# Altium project MyPCB01.PrjPcb
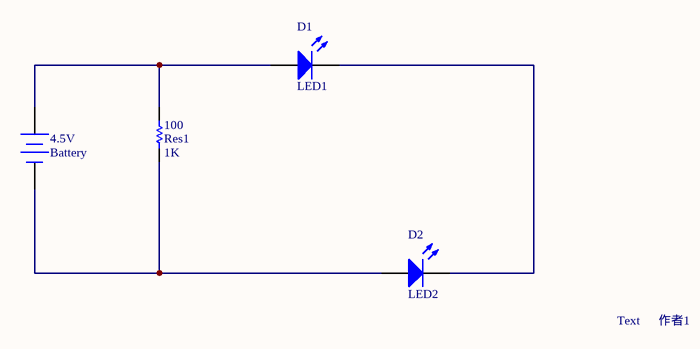
[diagram p0: MyFirstSch.SchDoc]
2 sheets, 5 parts. Net scope: global (net labels, ports and power ports of the same name join across sheets).
Board file: MyFirstPCB.PcbDoc
Sheets:
  MyFirstSch.SchDoc
  zf_2.SchDoc

## Sheet MyFirstSch.SchDoc
size A

### Parts
4.5V  Battery  [BAT-2]
100  Res1  value 1K  [AXIAL-0.3]
D1  LED1  [3.2X1.6X1.1]
D2  LED2  [3.2X1.6X1.1]

### Nets
Net4.5V_1: 4.5V.1(+) 100.1 D1.1(A)
Net4.5V_2: 4.5V.2(-) 100.2 D2.1(A)
NetD1_2: D1.2(K) D2.2(K)

### Notes on the sheet
- Text
- 作者1

### Library data of the parts
4.5V = Battery: Multicell Battery; Published: 24-Mar-1999; LatestRevisionDate: 17-Jul-2002; LatestRevisionNote: Re-released for DXP Platform.; PackageReference: BAT-2; Publisher: Altium Limited; PackageDescription: Battery; 2 Leads
100 = Res1: Resistor; Published: 8-Jun-2000; LatestRevisionDate: 17-Jul-2002; LatestRevisionNote: Re-released for DXP Platform.; PackageReference: AXIAL-0.3; Publisher: Altium Limited; PackageDescription: Axial Device, Thru-Hole; 2 Leads; 0.3 in Pin Spacing
D1 D2 = LED2: Typical RED, GREEN, YELLOW, AMBER GaAs LED; Published: 8-Jun-2000; LatestRevisionDate: 17-Jul-2002; LatestRevisionNote: Re-released for DXP Platform.; PackageVersion: Feb-2002; PackageReference: 3.2X1.6X1.1; Publisher: Altium Limited; PackageDescription: SM LED; 2 Flat Leads

## Sheet zf_2.SchDoc
size A
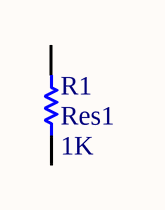
[diagram p1: zf_2.SchDoc]

### Parts
R1  Res1  value 1K  [AXIAL-0.3]

### Nets

Not connected (* = marked no-connect by the designer): R1 1 2

### Library data of the parts
R1 = Res1: Resistor; Published: 8-Jun-2000; LatestRevisionDate: 17-Jul-2002; LatestRevisionNote: Re-released for DXP Platform.; PackageReference: AXIAL-0.3; Publisher: Altium Limited; PackageDescription: Axial Device, Thru-Hole; 2 Leads; 0.3 in Pin Spacing